# Altium schematic sheet bmsMaster_main.SchDoc
size B; SheetNumber: 2; SheetTotal: 9
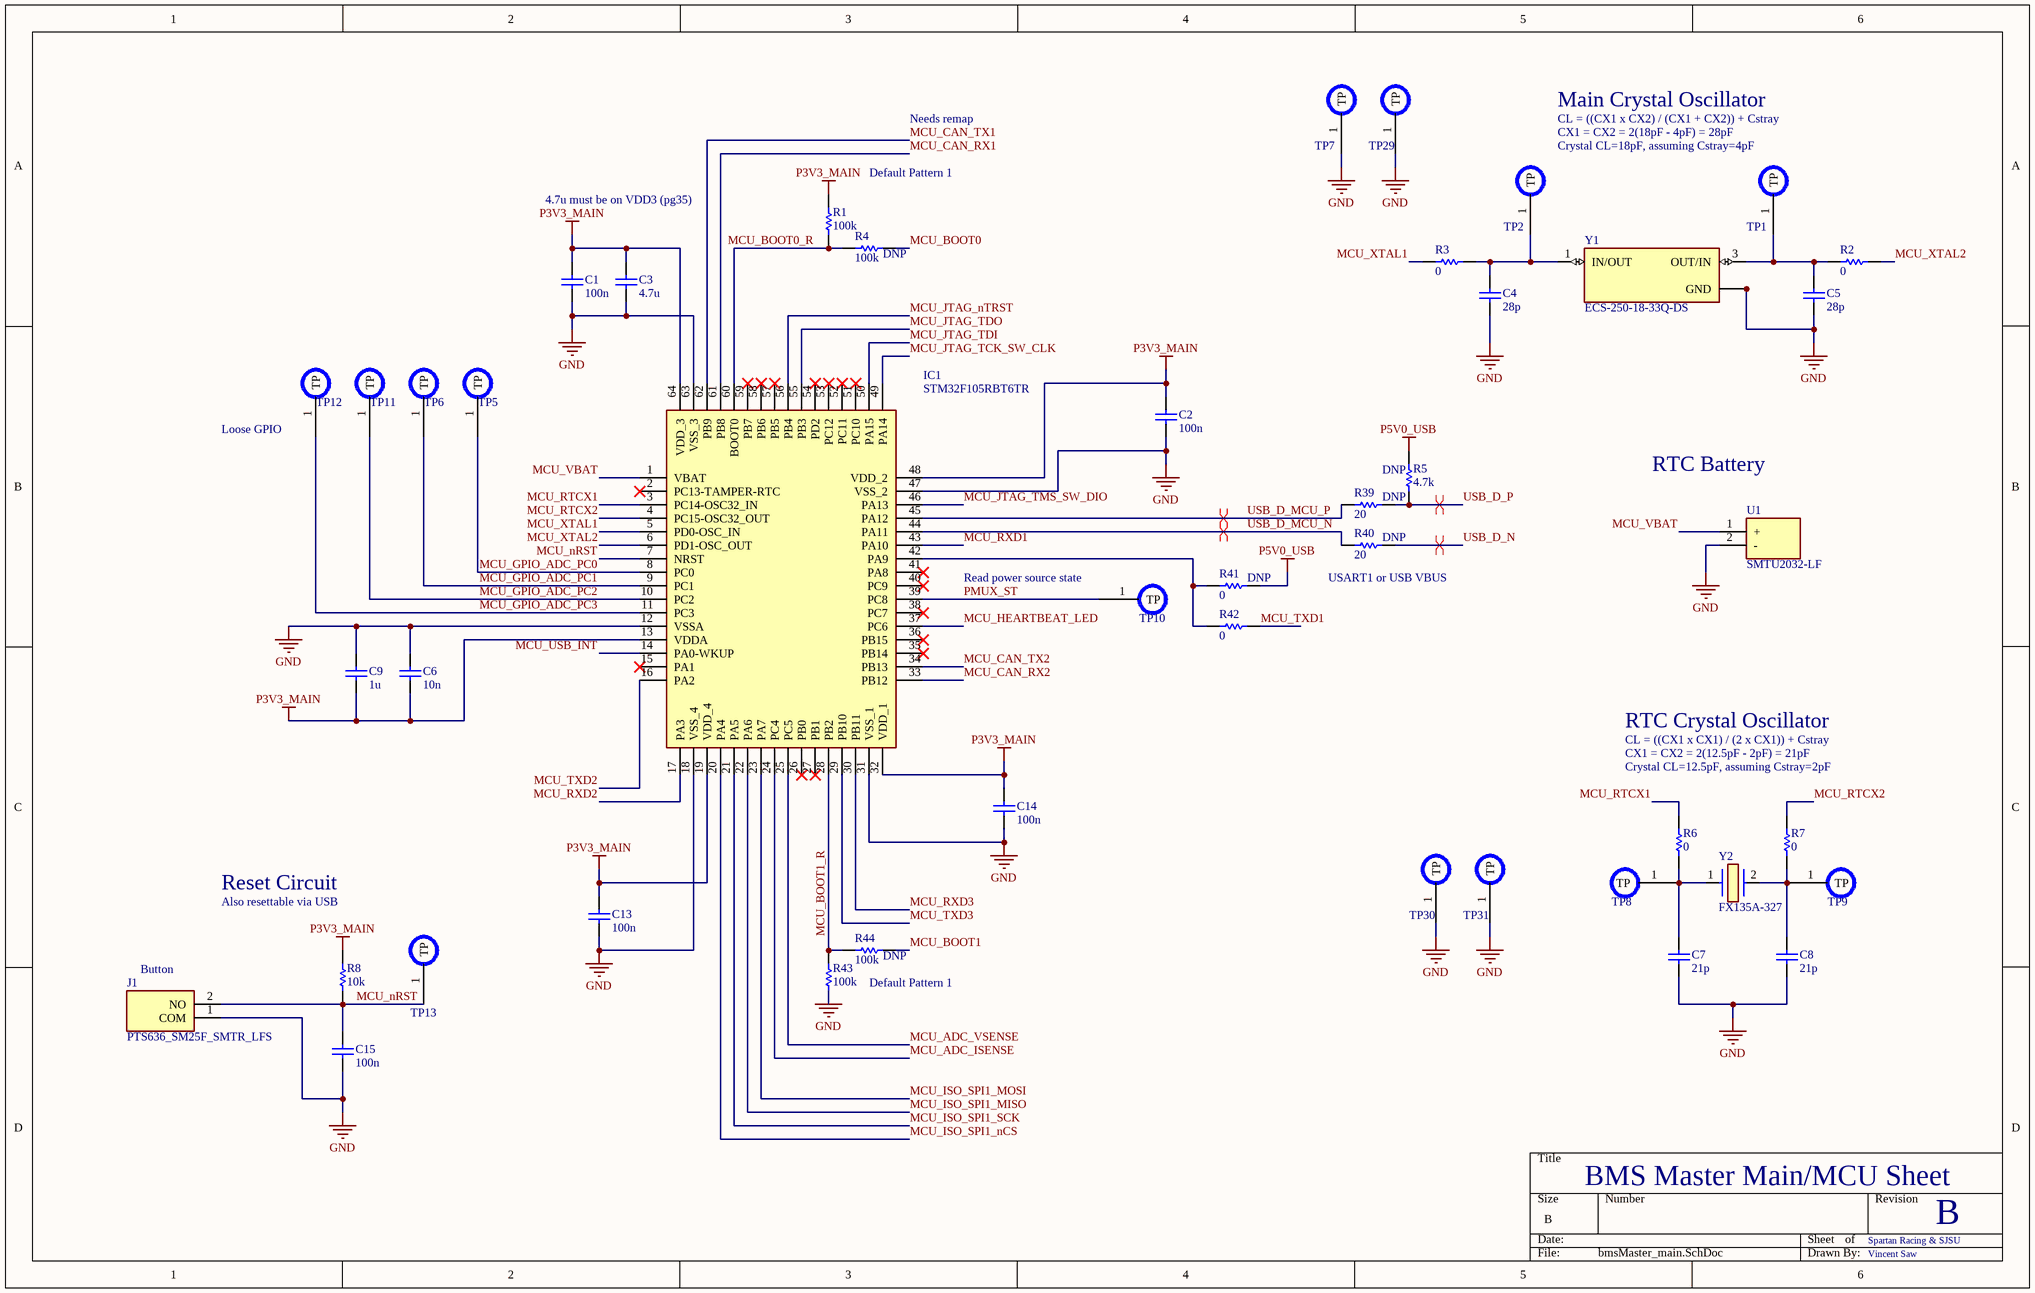
[diagram p0: bmsMaster_main.SchDoc]

## Parts
C1  value 100n  [CAPC1608X90N]  (hidden comment: Capacitor)
C2  value 100n  [CAPC1608X90N]  (hidden comment: Capacitor)
C3  value 4.7u  [CAPC1608X90N]  (hidden comment: Capacitor)
C4  value 28p  [CAPC1608X90N]  (hidden comment: Capacitor)
C5  value 28p  [CAPC1608X90N]  (hidden comment: Capacitor)
C6  value 10n  [CAPC1608X90N]  (hidden comment: Capacitor)
C7  value 21p  [CAPC1608X90N]  (hidden comment: Capacitor)
C8  value 21p  [CAPC1608X90N]  (hidden comment: Capacitor)
C9  value 1u  [CAPC1608X90N]  (hidden comment: Capacitor)
C13  value 100n  [CAPC1608X90N]  (hidden comment: Capacitor)
C14  value 100n  [CAPC1608X90N]  (hidden comment: Capacitor)
C15  value 100n  [CAPC1608X90N]  (hidden comment: Capacitor)
IC1  STM32F105RBT6TR  [QFP50P1200X1200X160-64N]
J1  PTS636_SM25F_SMTR_LFS  [PTS636SM25FSMTRLFS]
R1  value 100k  [RESC1608X50N]  (hidden comment: Resistor)
R2  value 0  [RESC1608X50N]  (hidden comment: Resistor)
R3  value 0  [RESC1608X50N]  (hidden comment: Resistor)
R4  value 100k  [RESC1608X50N]  (hidden comment: Resistor)
R5  value 4.7k  [RESC1608X50N]  (hidden comment: Resistor)
R6  value 0  [RESC1608X50N]  (hidden comment: Resistor)
R7  value 0  [RESC1608X50N]  (hidden comment: Resistor)
R8  value 10k  [RESC1608X50N]  (hidden comment: Resistor)
R39  value 20  [RESC1608X50N]  (hidden comment: Resistor)
R40  value 20  [RESC1608X50N]  (hidden comment: Resistor)
R41  value 0  [RESC1608X50N]  (hidden comment: Resistor)
R42  value 0  [RESC1608X50N]  (hidden comment: Resistor)
R43  value 100k  [RESC1608X50N]  (hidden comment: Resistor)
R44  value 100k  [RESC1608X50N]  (hidden comment: Resistor)
TP1  TSTPT  [Testpoint1]  (value not drawn)  (no BOM)
TP2  TSTPT  [Testpoint1]  (value not drawn)  (no BOM)
TP5  TSTPT  [Testpoint1]  (value not drawn)  (no BOM)
TP6  TSTPT  [Testpoint1]  (value not drawn)  (no BOM)
TP7  TSTPT  [Testpoint1]  (value not drawn)  (no BOM)
TP8  TSTPT  [Testpoint1]  (value not drawn)  (no BOM)
TP9  TSTPT  [Testpoint1]  (value not drawn)  (no BOM)
TP10  TSTPT  [Testpoint1]  (value not drawn)  (no BOM)
TP11  TSTPT  [Testpoint1]  (value not drawn)  (no BOM)
TP12  TSTPT  [Testpoint1]  (value not drawn)  (no BOM)
TP13  TSTPT  [Testpoint1]  (value not drawn)  (no BOM)
TP29  TSTPT  [Testpoint1]  (value not drawn)  (no BOM)
TP30  TSTPT  [Testpoint1]  (value not drawn)  (no BOM)
TP31  TSTPT  [Testpoint1]  (value not drawn)  (no BOM)
U1  SMTU2032-LF  [SMTU2032LF]
Y1  ECS-250-18-33Q-DS  [XTAL_ECS-250-18-33Q-DS]
Y2  FX135A-327  [FX135A327]

## Nets
GND: C1.1 C2.1 C3.1 C4.1 C5.1 C6.2 C7.1 C8.1 C9.2 C13.1 C14.1 C15.1 IC1.12(VSSA) IC1.18(VSS_4) IC1.31(VSS_1) IC1.47(VSS_2) IC1.63(VSS_3) J1.1(COM) R43.2 TP7.1(TP) TP29.1(TP) TP30.1(TP) TP31.1(TP) U1.2(-) Y1.2(GND) Y1.4(GND)
P3V3_MAIN: C1.2 C2.2 C3.2 C6.1 C9.1 C13.2 C14.2 IC1.13(VDDA) IC1.19(VDD_4) IC1.32(VDD_1) IC1.48(VDD_2) IC1.64(VDD_3) R1.2 R8.2
P5V0_USB: R5.2 R41.2
MCU_ADC_ISENSE: IC1.24(PC4)
MCU_ADC_VSENSE: IC1.25(PC5)
MCU_BOOT0: R4.2
MCU_BOOT0_R: IC1.60(BOOT0) R1.1 R4.1
MCU_BOOT1: R44.1
MCU_BOOT1_R: IC1.28(PB2) R43.1 R44.2
MCU_CAN_RX1: IC1.61(PB8)
MCU_CAN_RX2: IC1.33(PB12)
MCU_CAN_TX1: IC1.62(PB9)
MCU_CAN_TX2: IC1.34(PB13)
MCU_GPIO_ADC_PC0: IC1.8(PC0) TP5.1(TP)
MCU_GPIO_ADC_PC1: IC1.9(PC1) TP6.1(TP)
MCU_GPIO_ADC_PC2: IC1.10(PC2) TP11.1(TP)
MCU_GPIO_ADC_PC3: IC1.11(PC3) TP12.1(TP)
MCU_HEARTBEAT_LED: IC1.37(PC6)
MCU_ISO_SPI1_MISO: IC1.22(PA6)
MCU_ISO_SPI1_MOSI: IC1.23(PA7)
MCU_ISO_SPI1_nCS: IC1.20(PA4)
MCU_ISO_SPI1_SCK: IC1.21(PA5)
MCU_JTAG_nTRST: IC1.56(PB4)
MCU_JTAG_TCK_SW_CLK: IC1.49(PA14)
MCU_JTAG_TDI: IC1.50(PA15)
MCU_JTAG_TDO: IC1.55(PB3)
MCU_JTAG_TMS_SW_DIO: IC1.46(PA13)
MCU_nRST: C15.2 IC1.7(NRST) J1.2(NO) R8.1 TP13.1(TP)
MCU_RTCX1: IC1.3(PC14-OSC32_IN) R6.1
MCU_RTCX2: IC1.4(PC15-OSC32_OUT) R7.1
MCU_RXD1: IC1.43(PA10)
MCU_RXD2: IC1.17(PA3)
MCU_RXD3: IC1.30(PB11)
MCU_TXD1: R42.2
MCU_TXD2: IC1.16(PA2)
MCU_TXD3: IC1.29(PB10)
MCU_USB_INT: IC1.14(PA0-WKUP)
MCU_VBAT: IC1.1(VBAT) U1.1(+)
MCU_XTAL1: IC1.5(PD0-OSC_IN) R3.2
MCU_XTAL2: IC1.6(PD1-OSC_OUT) R2.1
PMUX_ST: IC1.39(PC8) TP10.1(TP)
USB_D_MCU_N: IC1.44(PA11) R40.1
USB_D_MCU_P: IC1.45(PA12) R39.1
USB_D_N: R40.2
USB_D_P: R5.1 R39.2
NetC4_2: C4.2 R3.1 TP2.1(TP) Y1.1(IN/OUT)
NetC5_2: C5.2 R2.2 TP1.1(TP) Y1.3(OUT/IN)
NetC7_2: C7.2 R6.2 TP8.1(TP) Y2.1
NetC8_2: C8.2 R7.2 TP9.1(TP) Y2.2
NetIC1_42: IC1.42(PA9) R41.1 R42.1

Not connected (* = marked no-connect by the designer): IC1 2(PC13-TAMPER-RTC)* 15(PA1)* 26(PB0)* 27(PB1)* 35(PB14)* 36(PB15)* 38(PC7)* 40(PC9)* 41(PA8)* 51(PC10)* 52(PC11)* 53(PC12)* 54(PD2)* 57(PB5)* 58(PB6)* 59(PB7)*

## Layout directives
differential pair: USB_D_MCU_N, USB_D_MCU_P, USB_D_N, USB_D_P

## Notes on the sheet
- Needs remap
- Main Crystal Oscillator
- CL = ((CX1 x CX2) / (CX1 + CX2)) + Cstray
- CX1 = CX2 = 2(18pF - 4pF) = 28pF
- Crystal CL=18pF, assuming Cstray=4pF
- 4.7u must be on VDD3 (pg35)
- Default Pattern 1
- (near R4) DNP
- (near TP12) Loose GPIO
- (near R39) DNP
- (near R5) DNP
- RTC Battery
- (near R40) DNP
- (near TP10) Read power source state
- (near R41) DNP
- (near R40) USART1 or USB VBUS
- RTC Crystal Oscillator
- CL = ((CX1 x CX1) / (2 x CX1)) + Cstray
- CX1 = CX2 = 2(12.5pF - 2pF) = 21pF
- Crystal CL=12.5pF, assuming Cstray=2pF
- Reset Circuit
- Also resettable via USB
- (near J1) Button
- (near R44) DNP
- BMS Master Main/MCU Sheet
- Spartan Racing & SJSU
- B
- Vincent Saw

## Library data of the parts
C1-C9 C13-C15 = Capacitor: SimulationGenericComponent: True
IC1 = STM32F105RBT6TR: Integrated Circuit; Manufacturer_Name: STMicroelectronics; Datasheet Link: http://www.st.com/content/ccc/resource/technical/document/datasheet/e4/f3/1a/89/5a/02/46/ae/CD00220364.pdf/files/CD00220364.pdf/jcr:content/translations/en.CD00220364.pdf; Height: 1.6mm; Manufacturer_Part_Number: STM32F105RBT6TR; Mouser Part Number: 511-STM32F105RBT6TR; Mouser Price/Stock: https://www.mouser.co.uk/ProductDetail/STMicroelectronics/STM32F105RBT6TR?qs=mxm%2FV7p14IMAWwOT6UWhYg%3D%3D; Arrow Part Number: STM32F105RBT6TR; Arrow Price/Stock: https://www.arrow.com/en/products/stm32f105rbt6tr/stmicroelectronics
J1 = PTS636_SM25F_SMTR_LFS: Connector; Manufacturer_Name: C & K COMPONENTS; Manufacturer_Part_Number: PTS636 SM25F SMTR LFS; Datasheet Link: https://ms.componentsearchengine.com/Datasheets/1/PTS636 SM25F SMTR LFS.pdf; Height: 2.7mm; Mouser Part Number: 611-PTS636SM25FSMTRL; Mouser Price/Stock: https://www.mouser.co.uk/ProductDetail/CK/PTS636-SM25F-SMTR-LFS?qs=vLWxofP3U2wcBTQSwfMFOw%3D%3D; Arrow Part Number: PTS636 SM25F SMTR LFS; Arrow Price/Stock: https://www.arrow.com/en/products/pts636-sm25f-smtr-lfs/ck
R1 R4 R5 R8 R39 R40 R43 R44 = Resistor: TC1: 0; SimulationGenericComponent: True; TC2: 0
R2 R3 R6 R7 R41 R42 = Resistor: SimulationGenericComponent: True; TC1: 0; TC2: 0
TP1 TP2 TP5-TP13 TP29-TP31 = Testpoint1
U1 = SMTU2032-LF: Undefined or Miscellaneous; Manufacturer_Name: RENATA; Datasheet Link: https://componentsearchengine.com/Datasheets/1/SMTU2032-LF.pdf; Height: 5mm; Manufacturer_Part_Number: SMTU2032-LF; Mouser Part Number: 614-SMTU2032-LF; Mouser Price/Stock: https://www.mouser.co.uk/ProductDetail/Renata/SMTU2032-LF?qs=r1PAtlylphCLeXbokB9Tog%3D%3D
Y1 = ECS-250-18-33Q-DS: MF: {'manufacturer': u'ECS Inc.'}; Package: None; Price: None; Value: *; MP: ECS-250-18-33Q-DS; Availability: Unavailable
Y2 = FX135A-327: Crystal or Oscillator; Manufacturer_Name: Fox; Datasheet Link: https://componentsearchengine.com/Datasheets/2/FX135A-327.pdf; Height: 0.9mm; Manufacturer_Part_Number: FX135A-327; Mouser Part Number: 559-FX135A-327; Mouser Price/Stock: https://www.mouser.co.uk/ProductDetail/Fox-Abracon/FX135A-327?qs=n5MbhIql%252BRlKJidsig7mKQ%3D%3D